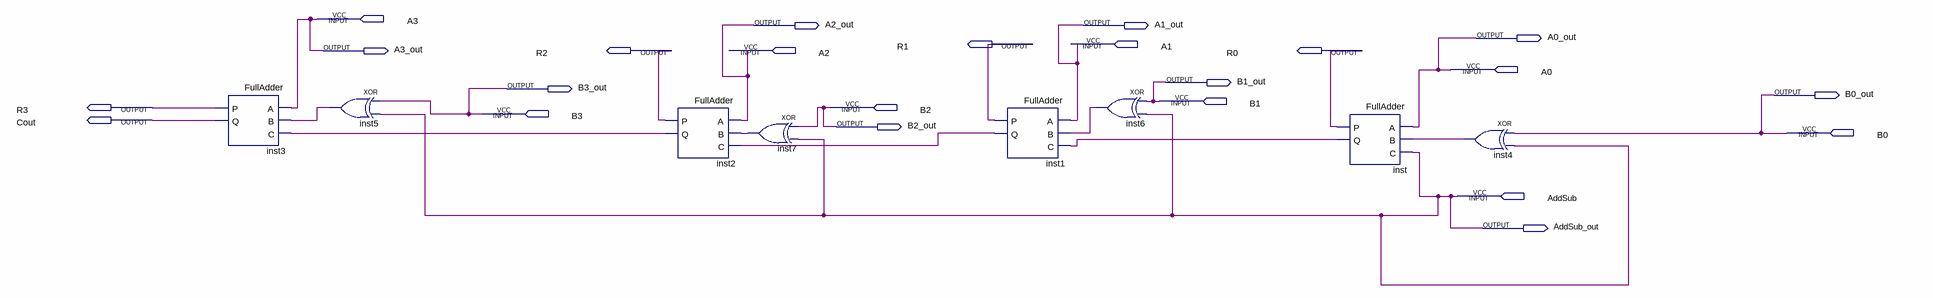
[diagram p0: schematic sheet]
// Quartus schematic Lab3Sec3_AdderSubtractor.bdf as structural Verilog: 8 symbols, 23 pins
module Lab3Sec3_AdderSubtractor (
  input  A3,
  input  A1,
  input  A2,
  input  A0,
  input  B1,
  input  B2,
  input  B3,
  input  B0,
  input  AddSub,
  output A2_out,
  output A1_out,
  output A0_out,
  output R1,
  output A3_out,
  output R2,
  output R0,
  output B1_out,
  output B3_out,
  output B0_out,
  output R3,
  output Cout,
  output B2_out,
  output AddSub_out
);

  wire inst1_q, inst2_q, inst4_out, inst5_out, inst6_out, inst7_out, inst_q;

  FullAdder inst3 (.A(A3), .B(inst5_out), .C(inst2_q), .P(R3), .Q(Cout));
  xor inst5 (inst5_out, B3, AddSub);
  FullAdder inst2 (.A(A2), .B(inst7_out), .C(inst1_q), .P(R2), .Q(inst2_q));
  xor inst7 (inst7_out, B2, AddSub);
  FullAdder inst1 (.A(A1), .B(inst6_out), .C(inst_q), .P(R1), .Q(inst1_q));
  xor inst6 (inst6_out, B1, AddSub);
  FullAdder inst (.A(A0), .B(inst4_out), .C(AddSub), .P(R0), .Q(inst_q));
  xor inst4 (inst4_out, B0, AddSub);

  assign A0_out = A0;
  assign A1_out = A1;
  assign A2_out = A2;
  assign A3_out = A3;
  assign AddSub_out = AddSub;
  assign B0_out = B0;
  assign B1_out = B1;
  assign B2_out = B2;
  assign B3_out = B3;
endmodule
